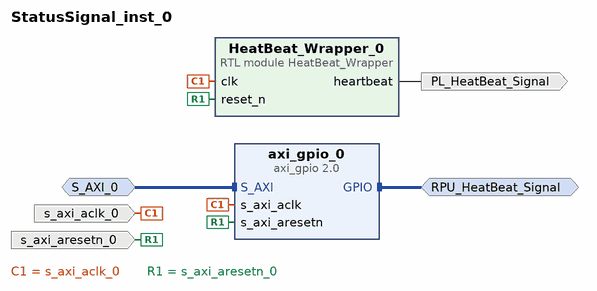
[diagram p0: block diagram of the top level]
# Vivado block design StatusSignal_inst_0, xck26-sfvc784-2LV-c, Vivado 2025.2
create_bd_design StatusSignal_inst_0

create_bd_intf_port -mode Master -vlnv xilinx.com:interface:gpio_rtl:1.0 RPU_HeatBeat_Signal
create_bd_intf_port -mode Slave -vlnv xilinx.com:interface:aximm_rtl:1.0 S_AXI_0
create_bd_port -dir O PL_HeatBeat_Signal
create_bd_port -dir I -type clk s_axi_aclk_0
create_bd_port -dir I -type rst s_axi_aresetn_0

create_bd_cell -type ip -vlnv xilinx.com:ip:axi_gpio:2.0 axi_gpio_0
set_property -dict [list \
  CONFIG.C_GPIO_WIDTH 1 \
  CONFIG.C_INTERRUPT_PRESENT 0 \
  CONFIG.GPIO_BOARD_INTERFACE Custom \
  CONFIG.USE_BOARD_FLOW true \
] [get_bd_cells axi_gpio_0]
create_bd_cell -type module -reference HeatBeat_Wrapper HeatBeat_Wrapper_0

# ---- connections ----

connect_bd_intf_net -intf_net S_AXI_0_1 [get_bd_intf_ports S_AXI_0] [get_bd_intf_pins axi_gpio_0/S_AXI]
connect_bd_intf_net [get_bd_intf_ports RPU_HeatBeat_Signal] [get_bd_intf_pins axi_gpio_0/GPIO]
connect_bd_net [get_bd_pins HeatBeat_Wrapper_0/heartbeat] [get_bd_ports PL_HeatBeat_Signal]
connect_bd_net -net s_axi_aclk_0_1 [get_bd_ports s_axi_aclk_0] [get_bd_pins axi_gpio_0/s_axi_aclk] [get_bd_pins HeatBeat_Wrapper_0/clk]
connect_bd_net -net s_axi_aresetn_0_1 [get_bd_ports s_axi_aresetn_0] [get_bd_pins axi_gpio_0/s_axi_aresetn] [get_bd_pins HeatBeat_Wrapper_0/reset_n]

# ---- address map ----
assign_bd_address -offset 0xB0000000 -range 64K -target_address_space [get_bd_addr_spaces S_AXI_0] [get_bd_addr_segs axi_gpio_0/S_AXI/Reg]
assign_bd_address -offset 0xB0000000 -range 64K -target_address_space [get_bd_addr_spaces S_AXI_0] [get_bd_addr_segs axi_gpio_0/S_AXI/Reg]

validate_bd_design
save_bd_design
